# Altium schematic sheet WIFI_BT.SchDoc
size A3; SheetNumber: 12; SheetTotal: 16
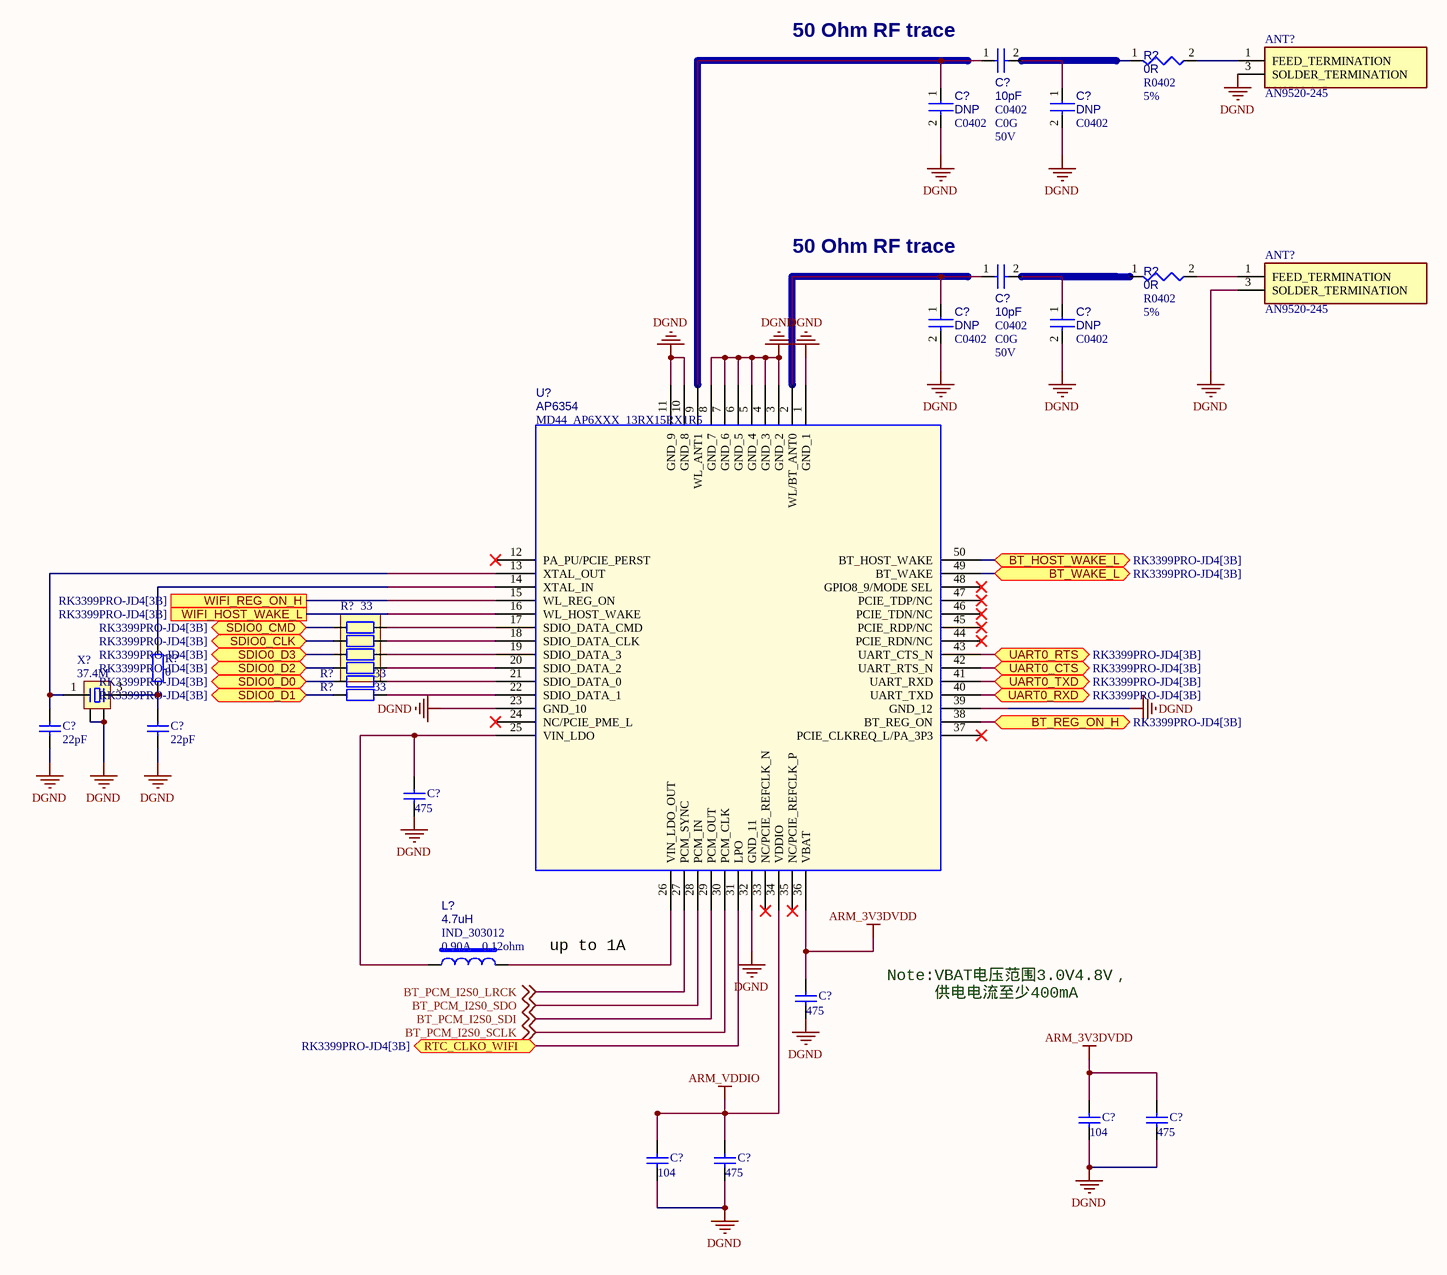
[diagram p0: WIFI_BT.SchDoc]

## Parts
(Parts that share a designator on the sheet are numbered #1, #2 ... from top to bottom, then left to right.)
ANT?#1  AN9520-245  [AN9520245]
ANT?#2  AN9520-245  [AN9520245]
C?#1  value 10pF  Voltage: 50V  Dielectric: C0G  [C0402]  (hidden comment: CAP NP_Dup3)
C?#2  value DNP  [C0402]  (hidden comment: CAP NP_Dup3)
C?#3  value DNP  [C0402]  (hidden comment: CAP NP_Dup3)
C?#4  value 10pF  Voltage: 50V  Dielectric: C0G  [C0402]  (hidden comment: CAP NP_Dup3)
C?#5  value DNP  [C0402]  (hidden comment: CAP NP_Dup3)
C?#6  value DNP  [C0402]  (hidden comment: CAP NP_Dup3)
C?#7  22pF  [C 0603_L]
C?#8  22pF  [C 0603_L]
C?#9  475  [C 0603_L]
C?#10  475  [C 0603_L]
C?#11  104  [C 0603_L]
C?#12  475  [C 0603_L]
C?#13  104  [C 0603_L]
C?#14  475  [C 0603_L]
L?  value 4.7uH  DC Resistor: 0.12ohm  Isat: 0.90A  PCB Footprint: IND_303012  [CD73]  (hidden comment: INDUCTORS OF FERRITE)
R?#1  value 0R  Tolerance: 5%  [R0402]  (hidden comment: RESISTOR_Dup2)
R?#2  value 0R  Tolerance: 5%  [R0402]  (hidden comment: RESISTOR_Dup2)
R?#3  33  [RCA-8P4R-0603]
R?#4  33  [R 0603_L]
R?#5  0  [R 0603_L]
R?#6  33  [R 0603_L]
U?  value AP6354  [MD44_AP6XXX_13RX15RX1R5]  (hidden comment: MODULE_AP6354)
X?  37.4M  [OSC 3225-4P]

## Ports
BT_HOST_WAKE_L (bidir, see RK3399PRO-JD4[3B]), BT_REG_ON_H (bidir, see RK3399PRO-JD4[3B]), BT_WAKE_L (bidir, see RK3399PRO-JD4[3B]), RTC_CLKO_WIFI (bidir, see RK3399PRO-JD4[3B]), SDIO0_CLK (bidir, see RK3399PRO-JD4[3B]), SDIO0_CMD (bidir, see RK3399PRO-JD4[3B]), SDIO0_D0 (bidir, see RK3399PRO-JD4[3B]), SDIO0_D1 (bidir, see RK3399PRO-JD4[3B]), SDIO0_D2 (bidir, see RK3399PRO-JD4[3B]), SDIO0_D3 (bidir, see RK3399PRO-JD4[3B]), UART0_CTS (bidir, see RK3399PRO-JD4[3B]), UART0_RTS (bidir, see RK3399PRO-JD4[3B]), UART0_RXD (bidir, see RK3399PRO-JD4[3B]), UART0_TXD (bidir, see RK3399PRO-JD4[3B]), WIFI_HOST_WAKE_L (see RK3399PRO-JD4[3B]), WIFI_REG_ON_H (see RK3399PRO-JD4[3B])

## Nets
ARM_3V3DVDD: C?#10.1 C?#11.1 C?#12.1 U?.36(VBAT)
ARM_VDDIO: C?#13.1 C?#14.1 U?.34(VDDIO)
DGND: ANT?#1.3(SOLDER_TERMINATION) ANT?#2.3(SOLDER_TERMINATION) C?#2.2 C?#3.2 C?#5.2 C?#6.2 C?#7.2 C?#8.2 C?#9.2 C?#10.2 C?#11.2 C?#12.2 C?#13.2 C?#14.2 U?.1(GND_1) U?.3(GND_2) U?.4(GND_3) U?.5(GND_4) U?.6(GND_5) U?.7(GND_6) U?.8(GND_7) U?.10(GND_8) U?.11(GND_9) U?.23(GND_10) U?.32(GND_11) U?.39(GND_12) X?.2 X?.4
BT_HOST_WAKE_L: U?.50(BT_HOST_WAKE) ; port BT_HOST_WAKE_L
BT_PCM_I2S0_LRCK: U?.27(PCM_SYNC) ; off-sheet BT_PCM_I2S0_LRCK
BT_PCM_I2S0_SCLK: U?.30(PCM_CLK) ; off-sheet BT_PCM_I2S0_SCLK
BT_PCM_I2S0_SDI: U?.29(PCM_OUT) ; off-sheet BT_PCM_I2S0_SDI
BT_PCM_I2S0_SDO: U?.28(PCM_IN) ; off-sheet BT_PCM_I2S0_SDO
BT_REG_ON_H: U?.38(BT_REG_ON) ; port BT_REG_ON_H
BT_WAKE_L: U?.49(BT_WAKE) ; port BT_WAKE_L
RTC_CLKO_WIFI: U?.31(LPO) ; port RTC_CLKO_WIFI
SDIO0_CLK: R?#3.2 ; port SDIO0_CLK
SDIO0_CMD: R?#3.1 ; port SDIO0_CMD
SDIO0_D0: R?#4.1 ; port SDIO0_D0
SDIO0_D1: R?#6.1 ; port SDIO0_D1
SDIO0_D2: R?#3.4 ; port SDIO0_D2
SDIO0_D3: R?#3.3 ; port SDIO0_D3
UART0_CTS: U?.42(UART_RTS_N) ; port UART0_CTS
UART0_RTS: U?.43(UART_CTS_N) ; port UART0_RTS
UART0_RXD: U?.40(UART_TXD) ; port UART0_RXD
UART0_TXD: U?.41(UART_RXD) ; port UART0_TXD
WIFI_HOST_WAKE_L: U?.16(WL_HOST_WAKE) ; port WIFI_HOST_WAKE_L
WIFI_REG_ON_H: U?.15(WL_REG_ON) ; port WIFI_REG_ON_H
NetANT?#1_1: ANT?#1.1(FEED_TERMINATION) R?#1.2
NetANT?#2_1: ANT?#2.1(FEED_TERMINATION) R?#2.2
NetC?#1_1: C?#1.1 C?#2.1 U?.9(WL_ANT1)
NetC?#1_2: C?#1.2 C?#3.1
NetC?#4_1: C?#4.1 C?#5.1 U?.2(WL/BT_ANT0)
NetC?#4_2: C?#4.2 C?#6.1
NetC?#7_1: C?#7.1 U?.13(XTAL_OUT) X?.1
NetC?#8_1: C?#8.1 R?#5.1 X?.3
NetC?#9_1: C?#9.1 L?.1 U?.25(VIN_LDO)
NetL?_2: L?.2 U?.26(VIN_LDO_OUT)
NetR?#3_5: R?#3.5 U?.20(SDIO_DATA_2)
NetR?#3_6: R?#3.6 U?.19(SDIO_DATA_3)
NetR?#3_7: R?#3.7 U?.18(SDIO_DATA_CLK)
NetR?#3_8: R?#3.8 U?.17(SDIO_DATA_CMD)
NetR?#4_2: R?#4.2 U?.21(SDIO_DATA_0)
NetR?#5_2: R?#5.2 U?.14(XTAL_IN)
NetR?#6_2: R?#6.2 U?.22(SDIO_DATA_1)

Not connected (* = marked no-connect by the designer): R?#1 1; R?#2 1; U? 12(PA_PU/PCIE_PERST)* 24(NC/PCIE_PME_L)* 33(NC/PCIE_REFCLK_N)* 35(NC/PCIE_REFCLK_P)* 37(PCIE_CLKREQ_L/PA_3P3)* 44(PCIE_RDN/NC)* 45(PCIE_RDP/NC)* 46(PCIE_TDN/NC)* 47(PCIE_TDP/NC)* 48(GPIO8_9/MODE_SEL)*

## Notes on the sheet
- (near C?#1) 50 Ohm RF trace
- (near C?#4) 50 Ohm RF trace
- up to 1A
- Note:VBAT电压范围3.0V4.8V，
  供电电流至少400mA

## Library data of the parts
ANT?#1 ANT?#2 = AN9520-245: Antenna; Manufacturer_Name: Rainsun microwave Tech; Datasheet Link: https://datasheet.lcsc.com/szlcsc/1810251713_Rainsun-microwave-Tech-AN9520-245_C99665.pdf; Height: 1.2mm; Manufacturer_Part_Number: AN9520-245
C?#1 = CAP NP_Dup3: cap,10.00pF,+/-0.5,50V,C0G,C0402; Part Reference: C6101; Manufacturer PN: C1005C0G1H100D050BA; Manufacturer: TDK; Tolerance: +/-0.5pF; Priority: A; PCB Footprint: C0402; Created by: JJJ; Part Type: C0402; RK PN: C1005C0G1H100D050BA
C?#2 = CAP NP_Dup3: Did Not Place.; Part Reference: C6102; Manufacturer PN: DNPC0402; Priority: A; PCB Footprint: C0402; Created by: JJJ; Part Type: DNP; RK PN: DNPC0402
C?#3 = CAP NP_Dup3: Did Not Place.; Part Reference: C6103; Manufacturer PN: DNPC0402; Priority: A; PCB Footprint: C0402; Created by: JJJ; Part Type: DNP; RK PN: DNPC0402
C?#4 = CAP NP_Dup3: cap,10.00pF,+/-0.5,50V,C0G,C0402; Part Reference: C6104; Manufacturer: TDK; RK PN: C1005C0G1H100D050BA; Priority: A; Tolerance: +/-0.5pF; PCB Footprint: C0402; Part Type: C0402; Manufacturer PN: C1005C0G1H100D050BA; Created by: JJJ
C?#5 = CAP NP_Dup3: Did Not Place.; Part Reference: C6105; RK PN: DNPC0402; Priority: A; PCB Footprint: C0402; Part Type: DNP; Manufacturer PN: DNPC0402; Created by: JJJ
C?#6 = CAP NP_Dup3: Did Not Place.; Part Reference: C6106; RK PN: DNPC0402; Priority: A; PCB Footprint: C0402; Part Type: DNP; Manufacturer PN: DNPC0402; Created by: JJJ
C?#7-C?#14 = Cap: Capacitor; Published: 8-Jun-2000; LatestRevisionDate: 17-Jul-2002; LatestRevisionNote: Re-released for DXP Platform.; PackageReference: RAD-0.3; Publisher: Altium Limited
  C?#7 C?#8: Value: 22pF
  C?#9 C?#10 C?#12 C?#14: Value: 475
  C?#11 C?#13: Value: 104
L? = INDUCTORS OF FERRITE: Power Inductor,4.7uH,0.2,IND_303012; Part Reference: L6101; Manufacturer PN: SWPA3012S4R7MT; Manufacturer: sunlord; Resonace frequency: 61M; Irms: 1.24A; Tolerance: 20%; Priority: A; Created by: YTL; Part Type: POWER_IND; RK PN: SWPA3012S4R7MT
R?#1 = RESISTOR_Dup2: 通用厚膜电阻,0R,+/-5%,R0402,1/16W.; Part Reference: R6102; Manufacturer: YAGEO; RK PN: RC0402JR-070RL; Priority: A; Wattage: 1/16W; PCB Footprint: R0402; Part Type: 通用厚膜电阻; Manufacturer PN: RC0402JR-070RL; Created by: YTL
R?#2 = RESISTOR_Dup2: 通用厚膜电阻,0R,+/-5%,R0402,1/16W.; Part Reference: R6104; Manufacturer: YAGEO; RK PN: RC0402JR-070RL; Priority: A; Wattage: 1/16W; PCB Footprint: R0402; Part Type: 通用厚膜电阻; Manufacturer PN: RC0402JR-070RL; Created by: YTL
R?#3 = R-8P4R: 贴片排阻; BOM名称: 贴片网络排阻
R?#4 R?#6 = 0805 电阻: 贴片电阻 0805 电阻; ComponentLink1Description: 供应商链接; ComponentLink1URL: http://www.szlcsc.com/product/details_18165.html; Package: 0805; Supplier: LC; SuppliersPartNumber: C17477
R?#5 = R: 贴片电阻; 版权归属: 来自淘宝 ID：黄晶宝石; 封装库来自淘宝卖家 ID：黄晶宝石: 其他店铺购入均为盗版，不享受售后技术支持服务，请立即申请退款; BOM名称: 贴片电阻; 联系售后: https://shop463601444.taobao.com
U? = MODULE_AP6354: 2x2 WiFi + Bluetooth4.1; Part Reference: U6101; Manufacturer: Ampak（正基科技）; Priority: A; PCB Footprint: MD44_AP6XXX_13RX15RX1R5; Created by: JJJ; Manufacturer PN: AP6354; Part Type: module; RK PN: AP6354
X? = XTAL-4P: 4脚无源晶振; 版权归属: 封装库来自淘宝卖家 ID：黄晶宝石; BOM名称: 4脚无源晶振; 学习资源: https://shop463601444.taobao.com